# EasyEDA Pro project lceda_pro_3plus_2.5.epro, schematic sch_main_4
Create Date: 2023-12-08; Page Name: P1; Project Name: THREE_2.0; Schematic Name: sch_main_4; Update Date: 2024-01-12; Add into BOM: yes; Company: M0dular; Convert to PCB: yes; Drawed: 嘉立创EDA; Page Size: A3; Part Number: JLCPCB-001; Reviewed: 嘉立创EDA; Version: 2.5
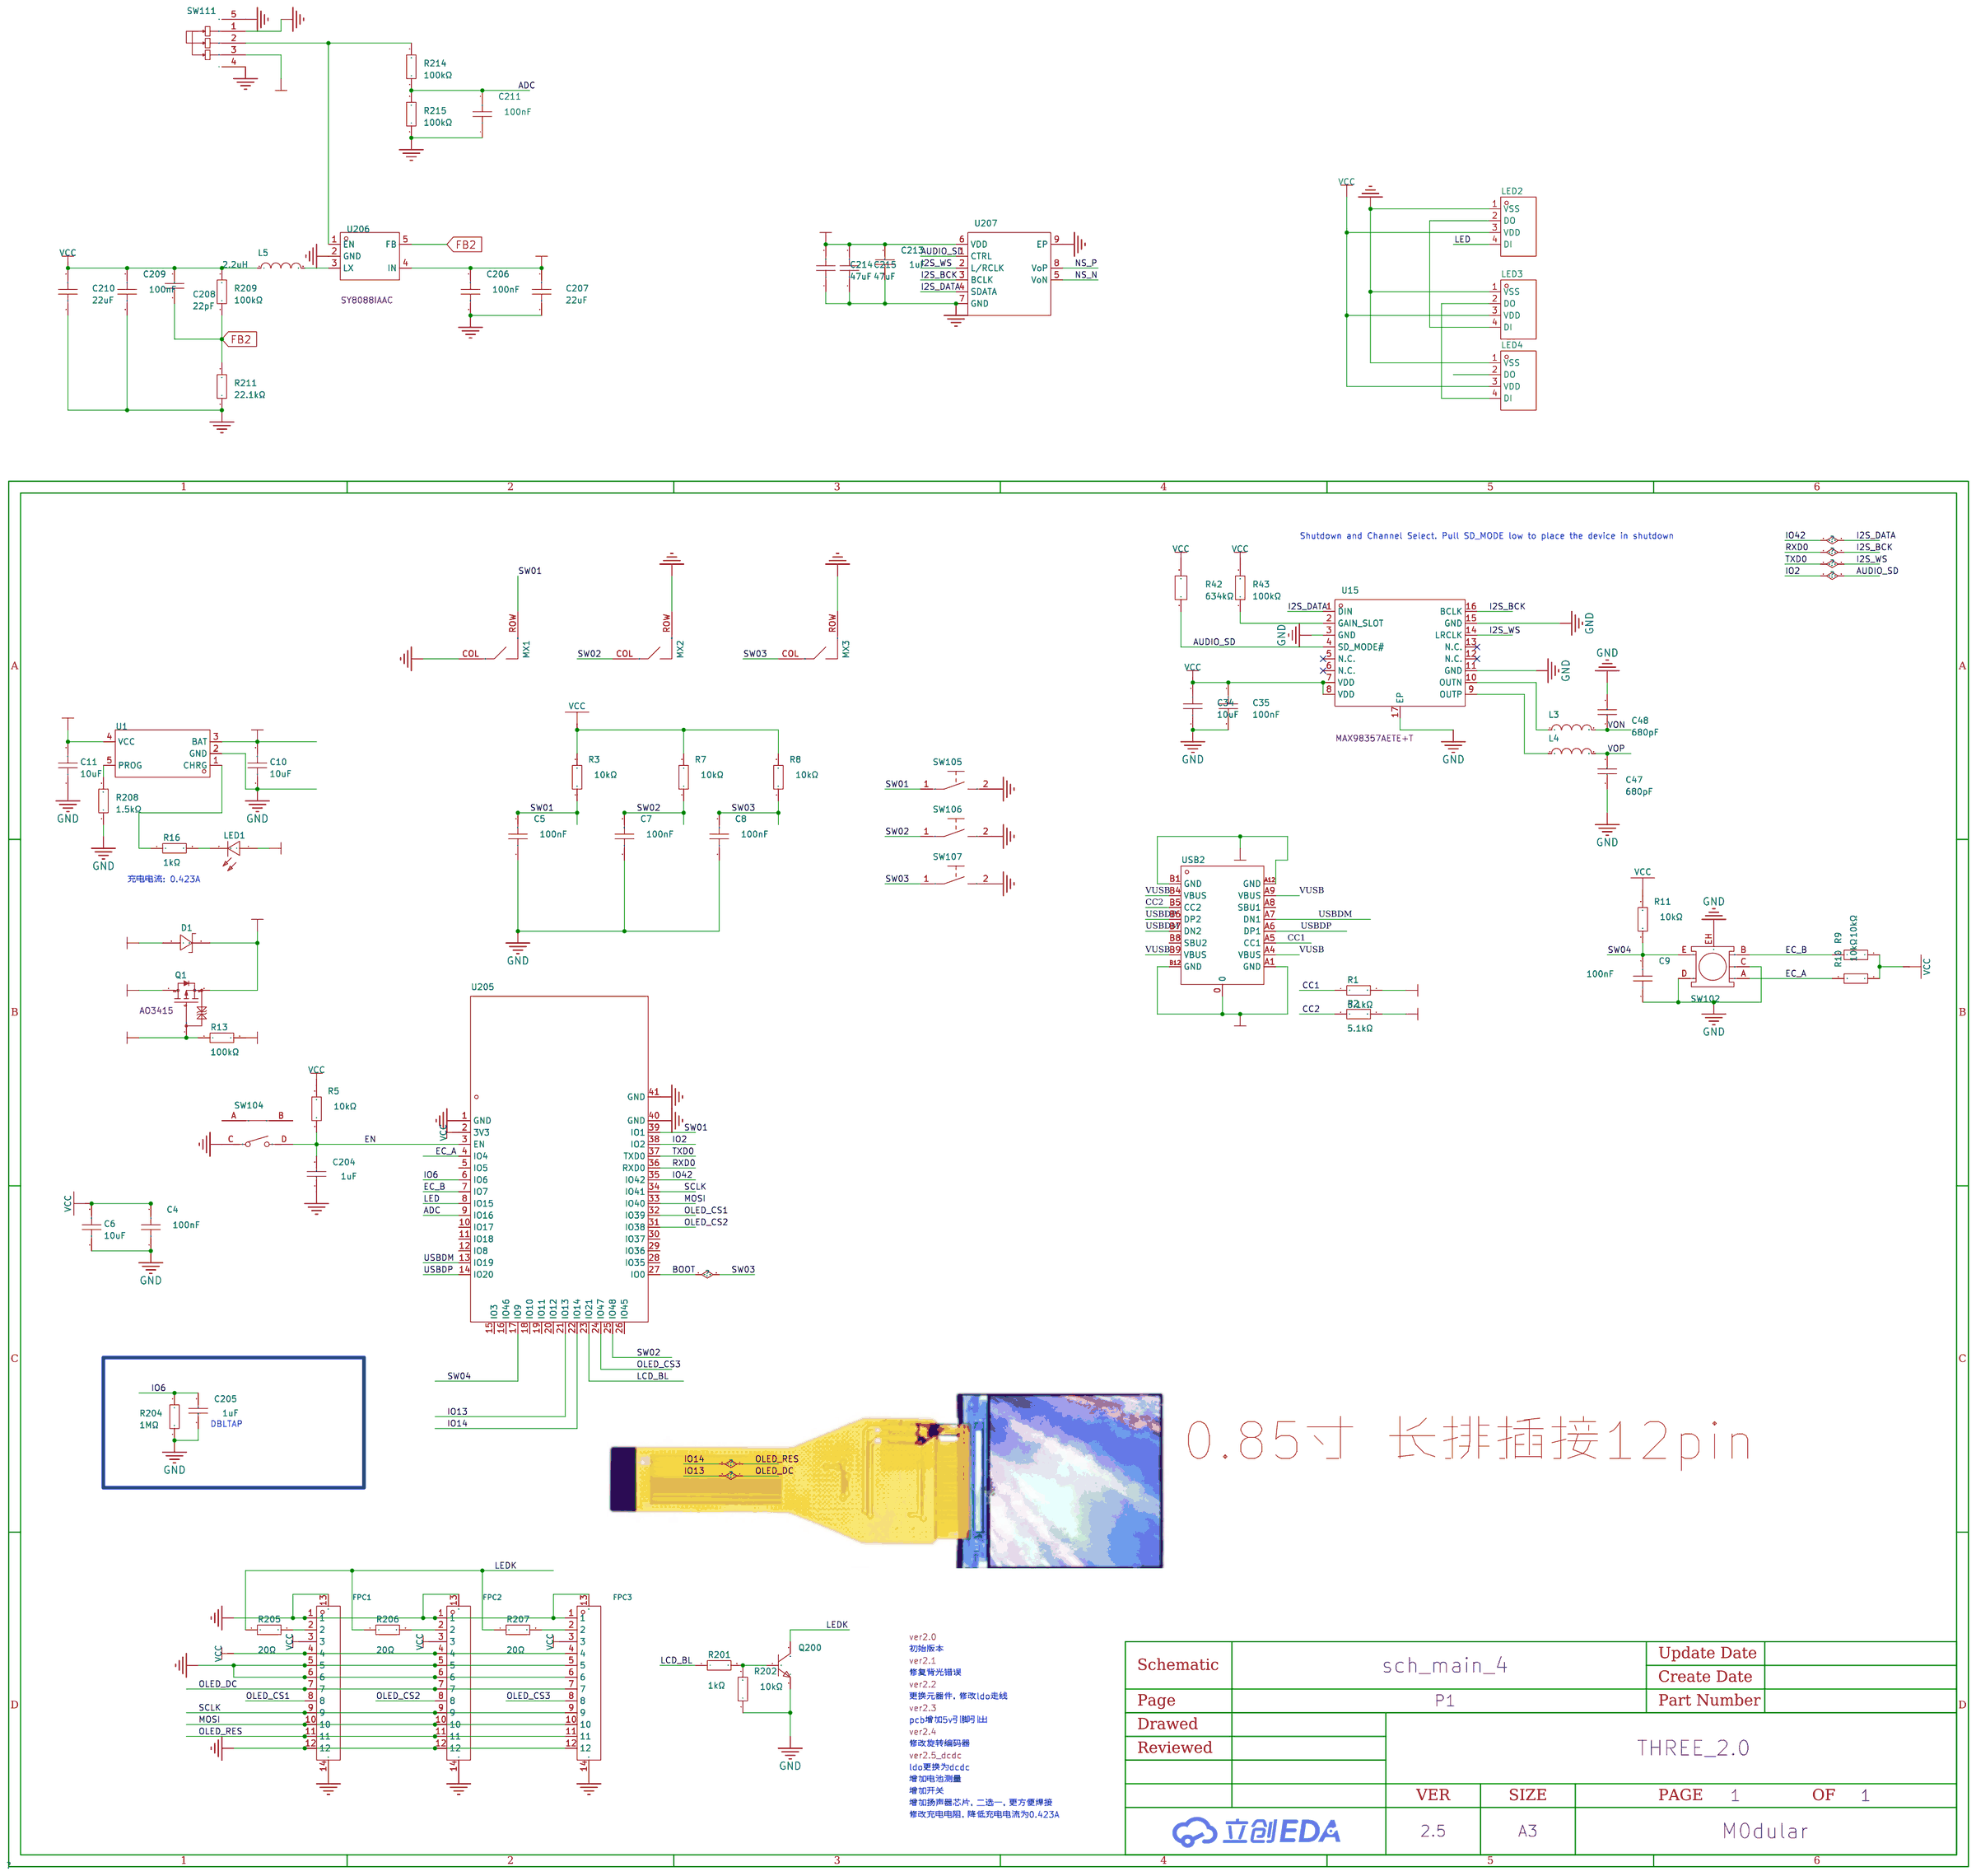
[diagram p0: schematic sheet]

## Parts
C4  100nF  [C0603]
C5  100nF  [C0603]
C6  10uF  [C0603]
C7  100nF  [C0603]
C8  100nF  [C0603]
C9  100nF  [C0603]
C10  10uF  [C0603]
C11  10uF  [C0603]
C34  10uF  [C0603]  (no BOM)
C35  100nF  [C0603]  (no BOM)
C47  680pF  [C0603]  (no BOM)
C48  680pF  [C0603]  (no BOM)
C204  1uF  [C0603]
C205  1uF  [C0603]
C206  100nF  [C0603]
C207  22uF  [C0805]
C208  22pF  [C0603]
C209  100nF  [C0603]
C210  22uF  [C0805]
C211  100nF  [C0603]
C213  1uF  [C0603]
C214  47uF  [C1206]
C215  47uF  [C1206]
D1  -  [sod-323_l1.8-w1.3-ls2.5-rd]
FPC1  FPC-05F-12PH20  [FPC-SMD_12P-P0.50_FPC-05F-12PH20]
FPC2  FPC-05F-12PH20  [FPC-SMD_12P-P0.50_FPC-05F-12PH20]
FPC3  FPC-05F-12PH20  [FPC-SMD_12P-P0.50_FPC-05F-12PH20]
L3  BLM18SG331TN1D  [L0603]  (no BOM)
L4  BLM18SG331TN1D  [L0603]  (no BOM)
L5  2.2uH  [IND-SMD_L4.0-W4.0]
LED1  -  [LED0603-R-RD]
LED2  XL-4020RGBC-WS2812B  [LED-SMD_4P-L4.0-W1.7_M4020-03003-RGB-862-001]
LED3  XL-4020RGBC-WS2812B  [LED-SMD_4P-L4.0-W1.7_M4020-03003-RGB-862-001]
LED4  XL-4020RGBC-WS2812B  [LED-SMD_4P-L4.0-W1.7_M4020-03003-RGB-862-001]
MX1  CPG151101S11-16  [CherryMX(KHS)-1.00U]
MX2  CPG151101S11-16  [CherryMX(KHS)-1.00U]
MX3  CPG151101S11-16  [CherryMX(KHS)-1.00U]
Q1  -  [SOT-23-3_L2.9-W1.3-P1.90-LS2.4-BR]
Q200  -  [SOT-23-3_L2.9-W1.3-P1.90-LS2.4-BR]
R1  5.1kΩ  [R0603]
R2  5.1kΩ  [R0603]
R3  10kΩ  [R0603]  (no BOM)
R5  10kΩ  [R0603]
R7  10kΩ  [R0603]  (no BOM)
R8  10kΩ  [R0603]  (no BOM)
R9  10kΩ  [R0603]
R10  10kΩ  [R0603]
R11  10kΩ  [R0603]  (no BOM)
R13  100kΩ  [R0603]
R16  1kΩ  [R0603]
R42  634kΩ  [R0603]  (no BOM)
R43  100kΩ  [R0603]  (no BOM)
R201  1kΩ  [R0603]
R202  10kΩ  [R0603]
R204  1MΩ  [R0603]
R205  20Ω  [R0603]
R206  20Ω  [R0603]
R207  20Ω  [R0603]
R208  1.5kΩ  [R0603]
R209  100kΩ  [R0603]
R211  22.1kΩ  [R0603]
R214  100kΩ  [R0603]
R215  100kΩ  [R0603]
SW102  EC11J1524413  [SW-SMD_EC11J1524413]
SW104  TS36CA-0.6  [SW-SMD_TS36CA]  (no BOM)
SW105  CPG151101S13  [KEY-TH_CPG1511F01S0X]
SW106  CPG151101S13  [KEY-TH_CPG1511F01S0X]
SW107  CPG151101S13  [KEY-TH_CPG1511F01S0X]
SW111  SK12D07VG4  [SW-TH_SK12D07VG4]
U1  -  [sot-23-5_l3.0-w1.7-p0.95-ls2.8-br]
U15  MAX98357AETE+T  [TQFN-16_L3.0-W3.0-P0.50-BL-EP1.5]  (no BOM)
U205  ESP32-S3-WROOM-1-N8R2  [WIRELM-SMD_ESP32-S3-WROOM-1]
U206  SY8088IAAC  [SOT-23-5_L3.0-W1.7-P0.95-LS2.8-BL]
U207  NS4168  [ESOP-8_L4.9-W3.9-P1.27-LS6.0-BL-EP-1]
USB2  -  [USB-C_SMD-TYPE-C-31-M-12]

## Library data of the parts
C4 C5 C7-C9 C206 C209 C211 = CL10B104KB8NNNC: 容值:100nF;精度:±10%;额定电压:50V;温度系数:X7R;; LCSC Part Name: 100nF ±10% 50V; Supplier Part: C1591; Manufacturer: SAMSUNG(三星); Supplier Footprint: 0603; JLCPCB Part Class: Extended Part; Datasheet: https://atta.szlcsc.com/upload/public/pdf/source/20160103/1457707680512.pdf; Supplier: LCSC; Tolerance: ±10%; Voltage Rated: 50V; Temperature Coefficient: X7R
C6 C10 C11 = CL10A106KP8NNNC: 容值:10uF;精度:±10%;额定电压:10V;温度系数:X5R;; LCSC Part Name: 10uF ±10% 10V; Supplier Part: C19702; Manufacturer: SAMSUNG(三星); Supplier Footprint: 0603; JLCPCB Part Class: Basic Part; Datasheet: https://atta.szlcsc.com/upload/public/pdf/source/20160103/1457707703378.pdf; Supplier: LCSC; Tolerance: ±10%; Voltage Rated: 10V; Temperature Coefficient: X5R
C34 = CL10A106KP8NNNC: 容值:10uF;精度:±10%;额定电压:10V;材质(温度系数):X5R;; LCSC Part Name: 10uF ±10% 10V; Supplier Part: C19702; Manufacturer: SAMSUNG(三星); Supplier Footprint: 0603; JLCPCB Part Class: Basic Part; Datasheet: https://atta.szlcsc.com/upload/public/pdf/source/20160103/1457707703378.pdf; Supplier: LCSC; Tolerance: ±10%; Voltage Rated: 10V; Temperature Coefficient: X5R
C35 = CL10B104KB8NNNC: 容值:100nF;精度:±10%;额定电压:50V;材质(温度系数):X7R;; LCSC Part Name: 100nF ±10% 50V; Supplier Part: C1591; Manufacturer: SAMSUNG(三星); Supplier Footprint: 0603; JLCPCB Part Class: Extended Part; Datasheet: https://atta.szlcsc.com/upload/public/pdf/source/20160218/1457707763339.pdf; Supplier: LCSC; Tolerance: ±10%; Voltage Rated: 50V; Temperature Coefficient: X7R
C47 C48 = 0603B681K500NT: 容值:680pF;精度:±10%;额定电压:50V;材质(温度系数):X7R;; LCSC Part Name: 680pF ±10% 50V; Supplier Part: C1630; Manufacturer: FH(风华); Supplier Footprint: 0603; JLCPCB Part Class: Basic Part; Datasheet: https://atta.szlcsc.com/upload/public/pdf/source/20170923/C1630_1506149298238988425.pdf; Supplier: LCSC; Tolerance: ±10%; Voltage Rated: 50V; Temperature Coefficient: X7R
C204 C205 C213 = CL10A105KB8NNNC: 温度系数:X5R;精度:±10%;额定电压:50V;容值:1uF;; LCSC Part Name: 1uF(105) ±10% 50V; Supplier Part: C15849; Manufacturer: SAMSUNG(三星); Supplier Footprint: 0603; JLCPCB Part Class: Basic Part; Datasheet: https://atta.szlcsc.com/upload/public/pdf/source/20160103/1457707679084.pdf; Supplier: LCSC; Temperature Coefficient: X5R; Tolerance: ±10%; Voltage Rated: 50V
C207 C210 = CL21A226MAQNNNE_C45783: 容值:22uF;精度:±20%;额定电压:25V;材质(温度系数):X5R;; LCSC Part Name: 22uF ±20% 25V; Supplier Part: C45783; Manufacturer: SAMSUNG(三星); Manufacturer Part: CL21A226MAQNNNE; Supplier Footprint: 0805; JLCPCB Part Class: 基础库; Datasheet: https://atta.szlcsc.com/upload/public/pdf/source/20160218/1457707763339.pdf; Supplier: LCSC; Tolerance: ±20%; Voltage Rated: 25V; Temperature Coefficient: X5R
C208 = CL10C220JB8NNNC: 容值:22pF;精度:±5%;额定电压:50V;材质(温度系数):C0G;; LCSC Part Name: 22pF ±5% 50V; Supplier Part: C1653; Manufacturer: SAMSUNG(三星); Supplier Footprint: 0603; JLCPCB Part Class: 基础库; Datasheet: https://atta.szlcsc.com/upload/public/pdf/source/20160218/1457707763339.pdf; Supplier: LCSC; Tolerance: ±5%; Voltage Rated: 50V; Temperature Coefficient: C0G
C214 C215 = GRM31CR61A476ME15L: 容值:47uF;精度:±20%;额定电压:10V;材质(温度系数):X5R;; LCSC Part Name: 47uF ±20% 10V; Supplier Part: C94034; Manufacturer: muRata(村田); Supplier Footprint: 1206; JLCPCB Part Class: Extended Part; Datasheet: https://atta.szlcsc.com/upload/public/pdf/source/20170310/1489116302849.pdf; Supplier: LCSC; Tolerance: ±20%; Voltage Rated: 10V; Temperature Coefficient: X5R
D1 = 1N5819WS: 直流反向耐压(Vr):40V;平均整流电流(Io):1A;正向压降(Vf):600mV@1A;; LCSC Part Name: 40V 1A 600mV@1A; Supplier Part: C191023; Manufacturer: Hottech(合科泰); Supplier Footprint: SOD-323; JLCPCB Part Class: Basic Part; Datasheet: https://atta.szlcsc.com/upload/public/pdf/source/20180614/C191023_3C6A6398B911F3A4C23E7538EE054643.pdf; Supplier: LCSC; Reverse Voltage (Vr): 40V; Average Rectified Current (Io): 1A; Forward Voltage (Vf@If): 600mV@1A
FPC1-FPC3 = FPC-05F-12PH20: 间距:0.5mm;触点数量:12P;锁定特性:翻盖式;触点类型:下接;安装类型:卧贴;工作温度范围:-25℃~+85℃;; Supplier: LCSC; Supplier Part: C2856799; Manufacturer: XUNPU(讯普); JLCPCB Part Class: Extended Part; LCSC Part Name: 间距:0.5mm P数:12P 翻盖式 下接; Supplier Footprint: SMD,P=0.5mm,卧贴; Datasheet: https://atta.szlcsc.com/upload/public/pdf/source/20210922/C2856799_794322F63241F1C59819430844B946BA.pdf; Pitch: 0.5mm; Number of Contacts: 12P; Locking Feature: 翻盖式; FFC, FCB Thickness: 0.3mm; Contact Type: 下接; Mounting Type: 卧贴; Height Above Board: 2mm; Operating Temperature Range: -25℃~+85℃
L3 L4 = BLM18SG331TN1D: 标称阻抗@测试频率:330Ω@100MHz;误差:±25%;直流电阻(RDC):70mΩ;; LCSC Part Name: 单路 0603磁珠 阻抗330Ω@100MHz; Supplier Part: C88989; Manufacturer: muRata(村田); Supplier Footprint: 0603; JLCPCB Part Class: Extended Part; Datasheet: https://atta.szlcsc.com/upload/public/pdf/source/20180326/C88989_E77110ECB70599E5C39DB4FE82EA7FD9.pdf; Supplier: LCSC; Impedance @ Frequency: 330Ω@100MHz; Tolerance: ±25%; DC Resistance: 70mΩ; Current Rating: 1.5A; Circuits: 1
L5 = YNR4030-2R2M: 电感值:2.2uH;精度:±20%;额定电流:2.95A;; LCSC Part Name: 2.2uH ±20%; Supplier Part: C340389; Manufacturer: YJYCOIN(益嘉源); Supplier Footprint: SMD,4x4x3mm; JLCPCB Part Class: Extended Part; Datasheet: https://atta.szlcsc.com/upload/public/pdf/source/20200623/C340386_9AA10DB3E9692149FF2BB278AFBCE083.pdf; Supplier: LCSC; Tolerance: ±20%; Rated Current: 2.95A; DC Resistance (DCR): 30mΩ
LED1 = 19-217/R6C-AL1M2VY/3T: 发光颜色:红灯;二极管配置:-;透镜颜色:无色透明;主波长:617.5nm;峰值波长:632nm;色温:-;光通量(25时):-;测试电流:5mA;正向电压(VF):2.2V;发光强度:28.5mcd;功率:60mW;发光角度:120°;安装方式:-;工作温度:-40~+85;; LCSC Part Name: 红灯; Supplier Part: C72044; Manufacturer: EVERLIGHT(台湾亿光); Supplier Footprint: 0603; JLCPCB Part Class: Extended Part; Datasheet: https://atta.szlcsc.com/upload/public/pdf/source/20160507/1462613613821.pdf; Supplier: LCSC; Emitted Color: 红灯; Lens Color: 无色透明; Dominant Wavelength: 617.5nm; Peak Wavelength: 632nm; Forward Current: 5mA; Forward Voltage (VF): 2.2V; Luminous Intensity: 28.5mcd; Power Dissipation: 60mW; Viewing Angle: 120°; Operating Temperature: -40~+85
LED2-LED4 = XL-4020RGBC-WS2812B: 发光颜色:RGB三色;二极管配置:-;透镜颜色:透明;主波长:-;峰值波长:-;色温:-;光通量(25℃时):-;测试电流:20mA;正向电压(VF):-;发光强度:-;功率:-;发光角度:-;安装方式:正贴;工作温度:-40℃~+85℃;; LCSC Part Name: RGB三色 正贴; Supplier Part: C3647024; Manufacturer: XINGLIGHT(成兴光); Supplier Footprint: SMD,2x4mm; JLCPCB Part Class: Extended Part; Datasheet: https://atta.szlcsc.com/upload/public/pdf/source/20220704/0D23B5490AD3232697BE6002ED360C9C.pdf; Supplier: LCSC; Emitted Color: RGB三色; Lens Color: 透明; Forward Current: 20mA; Mounting Sytle: 正贴; Operating Temperature: -40℃~+85℃
MX1-MX3 = CPG151101S11-16: 轴类型:-;工作电压:2V~12V;操作力:-;触底力:-;触发行程:-;总行程:-;针脚数:-;机械寿命:-;工作温度:-;; Supplier Part: C5156480; Manufacturer: Kailh(凯华); JLCPCB Part Class: Extended Part; Datasheet: https://atta.szlcsc.com/upload/public/pdf/source/20220829/33DFC1A320A078D20879F2B21562B513.pdf; Supplier: LCSC; Operating Voltage: 2V~12V
Q1 = AO3415_C181094: 类型:P沟道;漏源电压(Vdss):20V;连续漏极电流(Id):4A;功率(Pd):1.5W;导通电阻(RDS(on)@Vgs,Id):41mΩ@4.5V,4A;阈值电压(Vgs(th)@Id):900mV@250A;; LCSC Part Name: P沟道 20V 4A; Supplier Part: C181094; Manufacturer: Hottech(合科泰); Manufacturer Part: AO3415; Supplier Footprint: SOT-23(SOT-23-3); JLCPCB Part Class: Extended Part; Datasheet: https://atta.szlcsc.com/upload/public/pdf/source/20180131/C181094_15173931965481329223.pdf; Supplier: LCSC; Type: P沟道; Drain Source Voltage (Vdss): 20V; Continuous Drain Current (Id): 4A; Power Dissipation (Pd): 1.5W; Drain Source On Resistance (RDS(on)@Vgs,Id): 41mΩ@4.5V,4A; Gate Threshold Voltage (Vgs(th)@Id): 900mV@250A
Q200 = SS8050 Y1 200-350 .: 集电极电流(Ic):1.5A;功率(Pd):300mW;晶体管类型:NPN;集射极击穿电压(Vceo):25V;; LCSC Part Name: SS8050Y1200-350.; Supplier Part: C2150; Manufacturer: CJ（江苏长电/长晶）; Manufacturer Part: SS8050; LCSC Stock: 138539; LCSC On Sale: 1; Supplier Footprint: SOT-23(SOT-23-3); Price: 0.126; JLCPCB Part Class: BasicPart; JLCPCB Stock: 708469; JLCPCB On Sale: 1; Datasheet: https://atta.szlcsc.com/upload/public/pdf/source/20140809/1457707209319.pdf; Supplier: LCSC; Collector Current (Ic): 1.5A; Power Dissipation (Pd): 300mW; Transistor Type: NPN; Collector-Emitter Breakdown Voltage (Vceo): 25V
R1 R2 = 0603WAF5101T5E: 电阻类型:厚膜电阻;阻值:5.1kΩ;精度:±1%;功率:1/10W;温度系数:±100ppm/;最大工作电压:75V;工作温度范围:-55~+155;; LCSC Part Name: 5.1kΩ ±1%; Supplier Part: C23186; Manufacturer: UNI-ROYAL(厚声); Supplier Footprint: 0603; JLCPCB Part Class: Basic Part; Datasheet: https://atta.szlcsc.com/upload/public/pdf/source/20200306/C422600_1E6D84923E4A46A82E41ADD87F860B5C.pdf; Supplier: LCSC; Type: 厚膜电阻; Tolerance: ±1%; Power(Watts): 1/10W; Temperature Coefficient: ±100ppm/; Overload Voltage (Max): 75V; Operating Temperature Range: -55~+155
R3 R5 R7-R11 = 0603WAF1002T5E: 电阻类型:厚膜电阻;阻值:10kΩ;精度:±1%;功率:1/10W;温度系数:±100ppm/;最大工作电压:75V;工作温度范围:-55~+155;; LCSC Part Name: 10kΩ ±1% 1/10W; Supplier Part: C25804; Manufacturer: UNI-ROYAL(厚声); Supplier Footprint: 0603; JLCPCB Part Class: Basic Part; Datasheet: https://atta.szlcsc.com/upload/public/pdf/source/20200306/C422600_1E6D84923E4A46A82E41ADD87F860B5C.pdf; Supplier: LCSC; Type: 厚膜电阻; Tolerance: ±1%; Power(Watts): 1/10W; Temperature Coefficient: ±100ppm/; Overload Voltage (Max): 75V; Operating Temperature Range: -55~+155
R13 R43 R209 R214 R215 = 0603WAF1003T5E: 精度:±1%;阻值:100kΩ;温度系数:±100ppm/;功率:1/10W;最大工作电压:75V;工作温度范围:-55~+155;; LCSC Part Name: 100KΩ ±1%; Supplier Part: C25803; Manufacturer: UNI-ROYAL(厚声); Supplier Footprint: 0603; JLCPCB Part Class: Basic Part; Datasheet: https://atta.szlcsc.com/upload/public/pdf/source/20170920/C25803_1505901551039983376.pdf; Supplier: LCSC; Tolerance: ±1%; Temperature Coefficient: ±100ppm/; Power(Watts): 1/10W; Overload Voltage (Max): 75V; Operating Temperature Range: -55~+155
R16 R201 = 0603WAF1001T5E: 电阻类型:厚膜电阻;阻值:1kΩ;精度:±1%;功率:1/10W;温度系数:±100ppm/;最大工作电压:75V;工作温度范围:-55~+155;; LCSC Part Name: 1kΩ ±1% 1/10W; Supplier Part: C21190; Manufacturer: UNI-ROYAL(厚声); Supplier Footprint: 0603; JLCPCB Part Class: Basic Part; Datasheet: https://atta.szlcsc.com/upload/public/pdf/source/20200306/C422600_1E6D84923E4A46A82E41ADD87F860B5C.pdf; Supplier: LCSC; Type: 厚膜电阻; Tolerance: ±1%; Power(Watts): 1/10W; Temperature Coefficient: ±100ppm/; Overload Voltage (Max): 75V; Operating Temperature Range: -55~+155
R42 = RC0603FR-07634KL: 电阻类型:厚膜电阻;阻值:634kΩ;精度:±1%;功率:100mW;; LCSC Part Name: 634kΩ ±1% 100mW; Supplier Part: C273753; Manufacturer: YAGEO(国巨); Supplier Footprint: 0603; JLCPCB Part Class: Extended Part; Datasheet: https://atta.szlcsc.com/upload/public/pdf/source/20191125/C273753_901BC2F8FEE117E6429E5D997CD78CF2.pdf; Supplier: LCSC; Type: 厚膜电阻; Tolerance: ±1%; Power(Watts): 100mW; Temperature Coefficient: ±100ppm/℃; Overload Voltage (Max): 75V; Operating Temperature Range: -55℃~+155℃
R202 = 0603WAF1002T5E: 电阻类型:厚膜电阻;阻值:10kΩ;精度:±1%;功率:100mW;; LCSC Part Name: 厚膜电阻 10kΩ ±1% 100mW; Supplier Part: C25804; Manufacturer: UNI-ROYAL(厚声); Supplier Footprint: 0603; JLCPCB Part Class: Basic Part; Datasheet: https://atta.szlcsc.com/upload/public/pdf/source/20200306/C422600_1E6D84923E4A46A82E41ADD87F860B5C.pdf; Supplier: LCSC; Type: 厚膜电阻; Tolerance: ±1%; Power(Watts): 100mW; Temperature Coefficient: ±100ppm/℃; Overload Voltage (Max): 75V; Operating Temperature Range: -55℃~+155℃
R204 = 0603WAF1004T5E: 电阻类型:厚膜电阻;阻值:1MΩ;精度:±1%;功率:100mW;; LCSC Part Name: 1MΩ ±1% 100mW; Supplier Part: C22935; Manufacturer: UNI-ROYAL(厚声); Supplier Footprint: 0603; JLCPCB Part Class: 基础库; Datasheet: https://atta.szlcsc.com/upload/public/pdf/source/20200306/C422600_1E6D84923E4A46A82E41ADD87F860B5C.pdf; Supplier: LCSC; Type: 厚膜电阻; Tolerance: ±1%; Power(Watts): 100mW; Temperature Coefficient: ±100ppm/℃; Overload Voltage (Max): 75V; Operating Temperature Range: -55℃~+155℃
R205-R207 = 0603WAF200JT5E: 电阻类型:厚膜电阻;阻值:20Ω;精度:±1%;功率:100mW;温度系数:±100ppm/℃;; LCSC Part Name: 20Ω ±1% 100mW; Supplier Part: C22950; Manufacturer: UNI-ROYAL(厚声); Supplier Footprint: 0603; JLCPCB Part Class: Basic Part; Datasheet: https://atta.szlcsc.com/upload/public/pdf/source/20200306/C422600_1E6D84923E4A46A82E41ADD87F860B5C.pdf; Supplier: LCSC; Type: 厚膜电阻; Tolerance: ±1%; Power(Watts): 100mW; Temperature Coefficient: ±100ppm/℃; Overload Voltage (Max): 75V; Operating Temperature Range: -55℃~+155℃
R208 = 0603WAF1501T5E: 阻值:1.5kΩ;精度:±1%;功率:100mW;温度系数:±100ppm/℃;电阻类型:厚膜电阻;; LCSC Part Name: 1.5kΩ ±1% 100mW 厚膜电阻; Supplier Part: C22843; Manufacturer: UNI-ROYAL(厚声); Supplier Footprint: 0603; JLCPCB Part Class: Basic Part; Datasheet: https://atta.szlcsc.com/upload/public/pdf/source/20200306/C422600_1E6D84923E4A46A82E41ADD87F860B5C.pdf; Supplier: LCSC; Tolerance: ±1%; Power(Watts): 100mW; Overload Voltage (Max): 75V; Temperature Coefficient: ±100ppm/℃; Type: 厚膜电阻; Operating Temperature Range: -55℃~+155℃
R211 = 0603WAF2212T5E: 阻值:22.1kΩ;精度:±1%;功率:100mW;温度系数:±100ppm/℃;电阻类型:厚膜电阻;; LCSC Part Name: 22.1kΩ ±1% 100mW 厚膜电阻; Supplier Part: C25961; Manufacturer: UNI-ROYAL(厚声); Supplier Footprint: 0603; JLCPCB Part Class: Extended Part; Datasheet: https://atta.szlcsc.com/upload/public/pdf/source/20200306/C422600_1E6D84923E4A46A82E41ADD87F860B5C.pdf; Supplier: LCSC; Type: 厚膜电阻; Tolerance: ±1%; Power(Watts): 100mW; Temperature Coefficient: ±100ppm/℃; Overload Voltage (Max): 75V; Operating Temperature Range: -55℃~+155℃
SW102 = EC11J1524413: Supplier Part: C470592; Manufacturer: ALPSALPINE(阿尔卑斯阿尔派); Supplier Footprint: SMD; JLCPCB Part Class: 扩展库; Datasheet: https://atta.szlcsc.com/upload/public/pdf/source/20191216/C470795_DE763ECE59BD49533DB26DB53E5D34B2.pdf; Supplier: LCSC
SW104 = TS36CA-0.6: 触点电流:50mA;额定电压(DC):12V;绝缘电阻:100MΩ;电路结构:单刀单掷;安装方式:卧贴;按钮形状:矩形按钮;按钮/盖帽颜色:黑色;作用力:250gf@±50gf;机械寿命:30000;工作温度:-20℃~+70℃;引脚样式:SMD接片;开关高度:3.5mm;; LCSC Part Name: 轻触开关 3*6*3.5侧按 直径0.6定位柱 白体黑头 250力度; Supplier Part: C2681481; Manufacturer: SHOU HAN(首韩); Supplier Footprint: SMD; JLCPCB Part Class: 扩展库; Datasheet: https://atta.szlcsc.com/upload/public/pdf/source/20210122/C2681481_EC49E45AE97AC1474E58FB36E84EF19B.pdf; Supplier: LCSC; Contact Current: 50mA; Voltage Rating (DC): 12V; Insulation Resistance: 100MΩ; Circuit: 单刀单掷; Mounting Style: 卧贴; Actuator Style: 矩形按钮; Actuator/Cap Color: 黑色; Operating Force: 250gf@±50gf; Mechanical Life: 30000; Operating Temperature: -20℃~+70℃; Pin Style: SMD接片; Switch Height: 3.5mm
SW105-SW107 = CPG151101S13: 轴类型:青轴;工作电压:2V~12V;操作力:50gf@±10gf;针脚数:2;; LCSC Part Name: KT 青轴; Supplier Part: C404353; Manufacturer: Kailh(凯华); Supplier Footprint: 插件; JLCPCB Part Class: 扩展库; Datasheet: https://atta.szlcsc.com/upload/public/pdf/source/20190830/C404353_03D773C25064FB6981E6251E455188E4.pdf; Supplier: LCSC; Axis Type: 青轴; Operating Voltage: 2V~12V; Operation Force: 50gf@±10gf; Tactile Force: 60gf@±10gf; Conduction Travel: 1.9mm; Total Travel: 4mm; Pin: 2; Mechanical Life: 7000万次; Operating Temperature: -10℃~+70℃
SW111 = SK12D07VG4: 电路结构:单刀双掷;安装方式:卧插;额定电流(DC):500mA;额定电压(DC):50V;额定电流(AC):-;额定电压(AC):-;机械寿命:5千次;; LCSC Part Name: 3脚2档位 卧插 滑动开关; Supplier Part: C393937; Manufacturer: SHOU HAN(首韩); Supplier Footprint: 插件; JLCPCB Part Class: Extended Part; Datasheet: https://atta.szlcsc.com/upload/public/pdf/source/20190521/C393937_939FE26E571CC67D2D532E953108A1B0.pdf; Supplier: LCSC; Circuit: 单刀双掷; Actuator Style: 矩形柱状; Pin Style: PC引脚; Switch Height: 8.8mm; Mounting Style: 卧插; Current Rating (DC): 500mA; Voltage Rating (DC): 50V; Mechanical Life: 5千次
U1 = TP4054-42-SOT25R: 充电电池的类型:-;电池单元组数:-;最大充电电流:-;充满的电池组电压:-;最大供应电压:-;; Supplier Part: C32574; Manufacturer: TOPPOWER(南京拓微); Supplier Footprint: SOT-23-5; JLCPCB Part Class: Basic Part; Datasheet: https://atta.szlcsc.com/upload/public/pdf/source/20140621/1457707095588.pdf; Supplier: LCSC
U15 = MAX98357AETE+T: 功放类型:-;输出功率:-;; Supplier Part: C910544; Manufacturer: ADI(亚德诺)/MAXIM(美信); Supplier Footprint: TQFN-16-EP(3x3); JLCPCB Part Class: Extended Part; Datasheet: https://atta.szlcsc.com/upload/public/pdf/source/20210106/C910544_CB6DE4B2CEE254A72E6BDB40E718D281.pdf; Supplier: LCSC
U205 = ESP32-S3-WROOM-1-N8R2: Supplier Part: C2913204; Manufacturer: ESPRESSIF(乐鑫); Supplier Footprint: SMD,18x25.5mm; JLCPCB Part Class: Extended Part; Datasheet: https://atta.szlcsc.com/upload/public/pdf/source/20220628/A2AC12B3C87735CAEB7EBE2DBE80936C.pdf; Supplier: LCSC
U206 = SY8088IAAC: Supplier Part: C479072; Manufacturer: silergy(矽力杰); Supplier Footprint: SOT-23-5; JLCPCB Part Class: 扩展库; Datasheet: https://atta.szlcsc.com/upload/public/pdf/source/20200117/C479072_33DBD93C562E6383E475C3BDEE4B4060.pdf; Supplier: LCSC
U207 = NS4168: Supplier Part: C9900042517; Supplier Footprint: ESOP-8; Supplier: LCSC
USB2 = USB-TYPE-C-018: 连接器类型:Type-C;标准:-;公母:母座;触点数量:16;端口数量:1;安装方式:卧贴;额定电流 - 电源:3A;工作温度范围:-25~+85;; Supplier Part: C2927038; Manufacturer: DEALON(德艺隆); Supplier Footprint: SMD; JLCPCB Part Class: Extended Part; Datasheet: https://atta.szlcsc.com/upload/public/pdf/source/20211217/CCD3D517E355E8E0CC52ABD8D5784AD8.pdf; Supplier: LCSC; Connector Type: Type-C; Gender: 母座; Number of Contacts: 16; Number of Ports: 1; Mounting Style: 卧贴; Current Rating - Power (Max): 3A; Operating Temperature Range: -25~+85

## Nets
GND: C4.1 C5.1 C6.1 C7.1 C8.1 C9.1 C10.1 C11.1 C34.1 C35.2 C47.1 C48.2 C204.1 C205.1 C206.1 C207.1 C209.1 C210.1 C211.1 C213.1 C214.1 C215.1 FPC1.1 FPC1.5 FPC1.6 FPC1.12 FPC1.13(0) FPC1.14(0) FPC2.1 FPC2.5 FPC2.6 FPC2.12 FPC2.13(0) FPC2.14(0) FPC3.1 FPC3.5 FPC3.6 FPC3.12 FPC3.13(0) FPC3.14(0) LED2.1(VSS) LED3.1(VSS) LED4.1(VSS) MX1.COL MX2.ROW MX3.ROW Q200.2(E) R1.2 R2.2 R13.2 R202.1 R204.1 R208.1 R211.1 R215.1 SW102.C SW102.D SW102.EH SW104.C SW105.2 SW106.2 SW107.2 SW111.1 SW111.4 SW111.5 U1.2(GND) U15.3(GND) U15.11(GND) U15.15(GND) U15.17(EP) U205.1(GND) U205.40(GND) U205.41(GND) U206.2(GND) U207.7(GND) U207.9(EP) USB2.0 USB2.A1(GND) USB2.A12(GND) USB2.B1(GND) USB2.B12(GND)
VBAT: C10.2 Q1.3(D) U1.3(BAT)
VCC: C4.2 C6.2 C34.2 C35.1 C208.2 C209.2 C210.2 FPC1.3 FPC1.4 FPC2.3 FPC2.4 FPC3.3 FPC3.4 L5.1 LED2.3(VDD) LED3.3(VDD) LED4.3(VDD) R3.2 R5.2 R7.2 R8.2 R9.1 R10.1 R11.2 R42.2 R43.2 R209.2 U15.7(VDD) U15.8(VDD) U205.2(3V3)
ADC: C211.2 R214.1 R215.2 U205.9(IO16)
AUDIO_SD: R42.1 U15.4(SD_MODE#) U205.38(IO2) U207.1(CTRL)
BOOT: C8.2 MX3.COL R8.1 SW107.1 U205.27(IO0)
CC1: R1.1 USB2.A5(CC1)
CC2: R2.1 USB2.B5(CC2)
EC_A: R10.2 SW102.A U205.4(IO4)
EC_B: R9.2 SW102.B U205.7(IO7)
EN: C204.2 R5.1 SW104.D U205.3(EN)
FB2: C208.1 R209.1 R211.2 U206.5(FB)
I2S_BCK: U15.16(BCLK) U205.36(RXD0) U207.3(BCLK)
I2S_DATA: U15.1(DIN) U205.35(IO42) U207.4(SDATA)
I2S_WS: U15.14(LRCLK) U205.37(TXD0) U207.2(L/RCLK)
IO6: C205.2 R204.2 U205.6(IO6)
IO13: FPC1.7 FPC2.7 FPC3.7 U205.21(IO13)
IO14: FPC1.11 FPC2.11 FPC3.11 U205.22(IO14)
LCD_BL: R201.1 U205.23(IO21)
LED: LED2.4(DI) U205.8(IO15)
LEDK: Q200.3(C) R205.1 R206.1 R207.1
MOSI: FPC1.10 FPC2.10 FPC3.10 U205.33(IO40)
NS_N: U207.5(VoN)
NS_P: U207.8(VoP)
OLED_CS1: FPC1.8 U205.32(IO39)
OLED_CS2: FPC2.8 U205.31(IO38)
OLED_CS3: FPC3.8 U205.24(IO47)
SCLK: FPC1.9 FPC2.9 FPC3.9 U205.34(IO41)
SW01: C5.2 MX1.ROW R3.1 SW105.1 U205.39(IO1)
SW02: C7.2 MX2.COL R7.1 SW106.1 U205.25(IO48)
SW04: C9.2 R11.1 SW102.E U205.17(IO9)
USBDM: U205.13(IO19) USB2.A7(DN1) USB2.B7(DN2)
USBDP: U205.14(IO20) USB2.A6(DP1) USB2.B6(DP2)
VON: C48.1 L3.2
VOP: C47.2 L4.2
VSYS: C206.2 C207.2 C213.2 C214.2 C215.2 D1.1(C) Q1.2(S) SW111.3 U206.4(IN) U207.6(VDD)
VUSB: C11.2 D1.2(A) LED1.1(A) Q1.1(G) R13.1 U1.4(VCC) USB2.A4(VBUS) USB2.A9(VBUS) USB2.B4(VBUS) USB2.B9(VBUS)
$1N48640: R208.2 U1.5(PROG)
$1N76182: R16.1 U1.1(CHRG)
$1N95276: Q200.1(B) R201.2 R202.2
$1N109191: R43.1 U15.2(GAIN_SLOT)
$1N109209: L3.1 U15.10(OUTN)
$1N109210: L4.1 U15.9(OUTP)
$1N112073: LED1.2(C) R16.2
$1N122714: FPC3.2 R207.2
$1N122760: FPC2.2 R206.2
$1N122794: FPC1.2 R205.2
$1N130028: L5.2 U206.3(LX)
$1N143787: R214.2 SW111.2 U206.1(EN)
$1N144439: LED2.2(DO) LED3.4(DI)
$1N144440: LED3.2(DO) LED4.4(DI)

Not connected (* = marked no-connect by the designer): LED4 2(DO); SW104 A B; U15 5(N.C.)* 6(N.C.)* 12(N.C.)* 13(N.C.)*; U205 5(IO5) 10(IO17) 11(IO18) 12(IO8) 15(IO3) 16(IO46) 18(IO10) 19(IO11) 20(IO12) 26(IO45) 28(IO35) 29(IO36) 30(IO37); USB2 A8(SBU1) B8(SBU2)

## Notes on the sheet
- Shutdown and Channel Select. Pull SD_MODE low to place the device in shutdown
- 充电电流: 0.423A
- DBLTAP
- 0.85寸 长排插接12pin
- ver2.0
- 初始版本
- ver2.1
- 修复背光错误
- ver2.2
- 更换元器件，修改ldo走线
- ver2.3
- pcb增加5v引脚引出
- ver2.4
- 修改旋转编码器
- ver2.5_dcdc
- ldo更换为dcdc
- 增加电池测量
- 增加开关
- 增加扬声器芯片，二选一，更方便焊接
- 修改充电电阻，降低充电电流为0.423A
